# EAGLE design RTC microSD Shield (EAGLE 5.11)
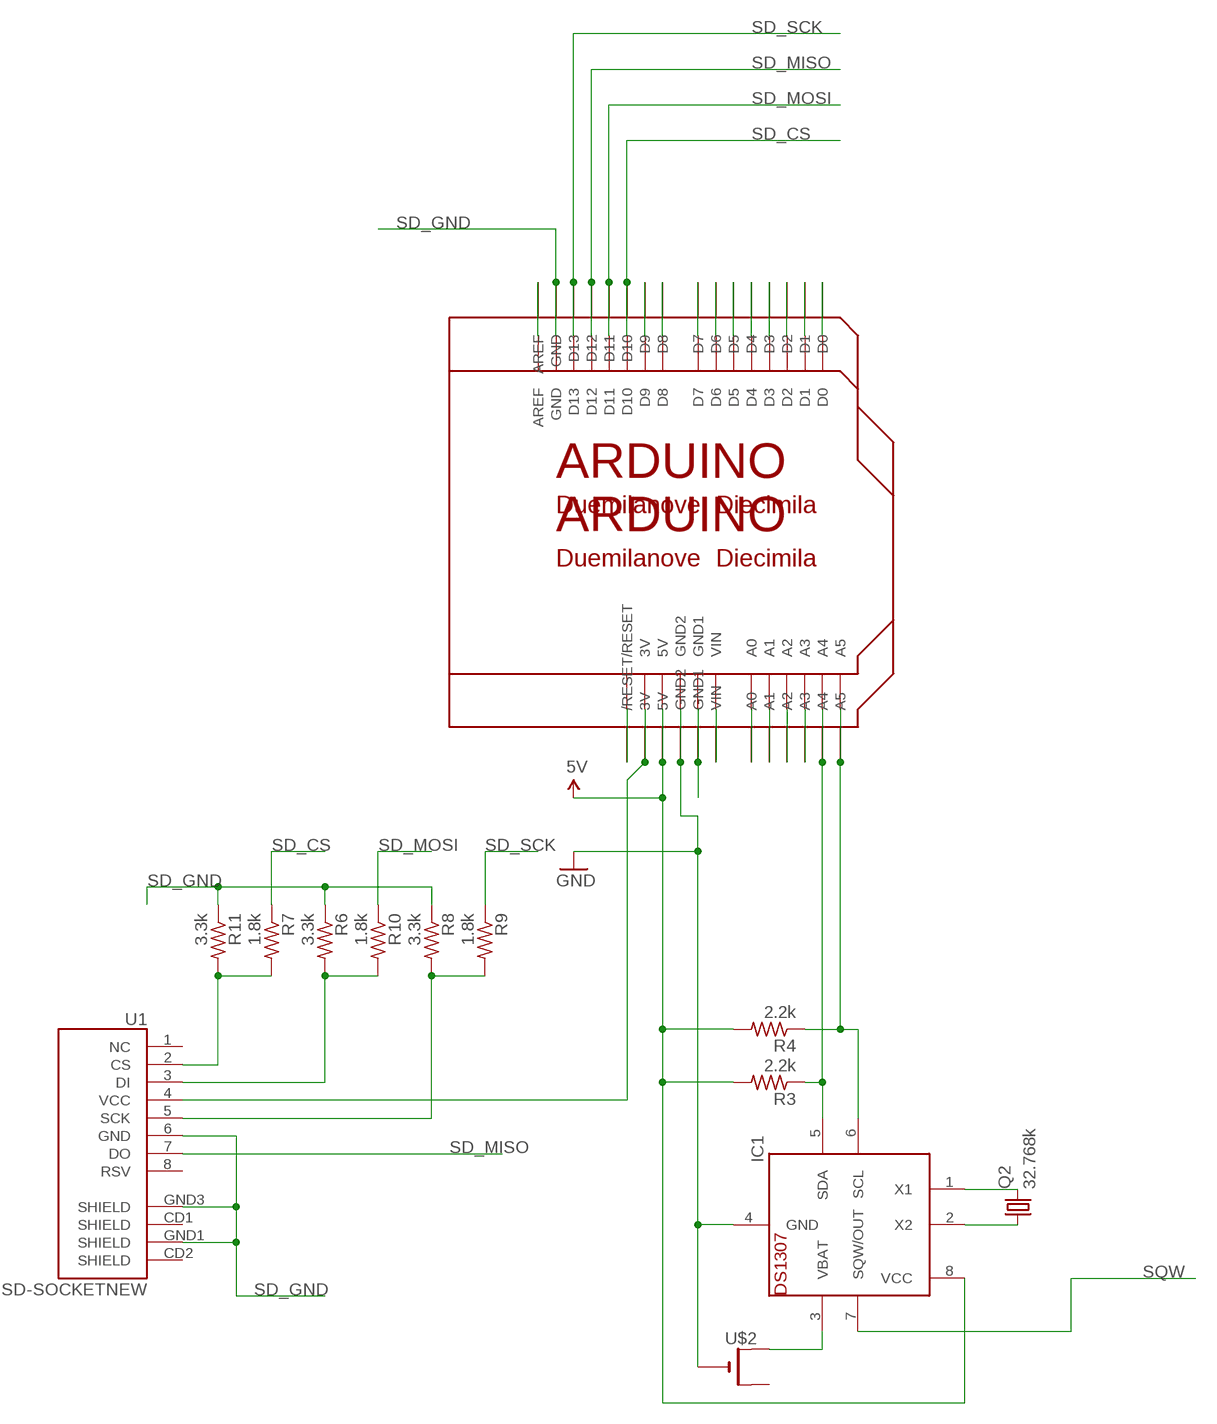
[diagram p0: schematic, sheet 1]

## Parts
IC1  DS1307  [DIL08]
Q2  32.768k  CRYSTALTC26H  [TC26H]
R3  2.2k  R-US_0207/10  [0207/10]
R4  2.2k  R-US_0207/10  [0207/10]
R6  3.3k  R-US_0207/10  [0207/10]
R7  1.8k  R-US_0207/10  [0207/10]
R8  3.3k  R-US_0207/10  [0207/10]
R9  1.8k  R-US_0207/10  [0207/10]
R10  1.8k  R-US_0207/10  [0207/10]
R11  3.3k  R-US_0207/10  [0207/10]
U1  USD-SOCKETNEW  [MICRO-SD-SOCKET-PP]
U$1  ARDUINOUNO  [ARDUINO]
U$2  CR1220THM  [CR1220-THM]
U$3  ARDUINOUNO  [ARDUINO]

## Nets
5V: IC1.8(VCC) R3.2 R4.2 U$1.5V U$3.5V
GND: IC1.4(GND) U$1.GND2 U$2.- U$3.GND2
N$1: U$1.AREF U$3.AREF
N$2: U$1.GND1 U$3.GND1
N$3: U$1.D9 U$3.D9
N$4: IC1.3(VBAT) U$2.+1(+)
N$5: IC1.1(X1) Q2.2
N$6: IC1.2(X2) Q2.1
N$7: IC1.5(SDA) R3.1 U$1.A4 U$3.A4
N$8: IC1.6(SCL) R4.1 U$1.A5 U$3.A5
N$9: U$1.D8 U$3.D8
N$10: U1.4(VCC) U$1.3V U$3.3V
N$11: R7.2 R11.2 U1.2(CS)
N$12: R6.2 R10.2 U1.3(DI)
N$13: R8.2 R9.2 U1.5(SCK)
N$14: U$1.D7 U$3.D7
N$15: U$1.D6 U$3.D6
N$16: U$1.D5 U$3.D5
N$17: U$1.D4 U$3.D4
N$18: U$1.D3 U$3.D3
N$19: U$1.D2 U$3.D2
N$20: U$1.D1 U$3.D1
N$21: U$1.D0 U$3.D0
N$22: U$1.RESET(/RESET) U$3.RESET(/RESET)
N$23: U$1.VIN U$3.VIN
N$24: U$1.A0 U$3.A0
N$25: U$1.A1 U$3.A1
N$26: U$1.A2 U$3.A2
N$27: U$1.A3 U$3.A3
SD_CS: R7.1 U$1.D10 U$3.D10
SD_GND: R6.1 R8.1 R11.1 U1.6(GND) U1.GND1(SHIELD) U1.GND3(SHIELD) U$1.GND U$3.GND
SD_MISO: U1.7(DO) U$1.D12 U$3.D12
SD_MOSI: R10.1 U$1.D11 U$3.D11
SD_SCK: R9.1 U$1.D13 U$3.D13
SQW: IC1.7(SQW/OUT)
Unconnected: U1.1(NC) U1.8(RSV) U1.CD1(SHIELD) U1.CD2(SHIELD) U$2.+2(+1)

## Library data of the parts
IC1 = adafruit:DS1307: DS1307 Real time clock (RTC) with battery backup ability. Talk to it via i2c
Q2 = crystal:CRYSTAL: CRYSTAL; OC_FARNELL: unknown; OC_NEWARK: unknown
R3 R4 R6-R11 = rcl:R-US_: RESISTOR, American symbol
U1 = SparkFun:USD-SOCKET: microSD Socket Push-push type uSD socket. Schematic element and footprint production proven. Spark Fun Electronics SKU : PRT-00127. tDoc lines correctly indicate media card edge positions when inserting (unlocked, locked, depressed).
U$1 U$3 = adafruit:ARDUINO: Arduino Diecimila/Duemilanove Make a shield with ease, this package has all the named pins as well as the two mounting drill holes and an outline of the USB and DC power connector. The outline is on the DIMENSION layer, so if your board house uses it they will cut the outline to match. http://www.ladyada.net/library/pcb/eaglelibrary.html
U$2 = adafruit:CR1220: CR1216/CR1220/CR1225 12mm 3V lithium coin cell Great for battery packup. Both SMT and THM holders. Note the THM package has the ground pads on both sides of the PCB so that the masks are the same - this reduces the cost

## Board
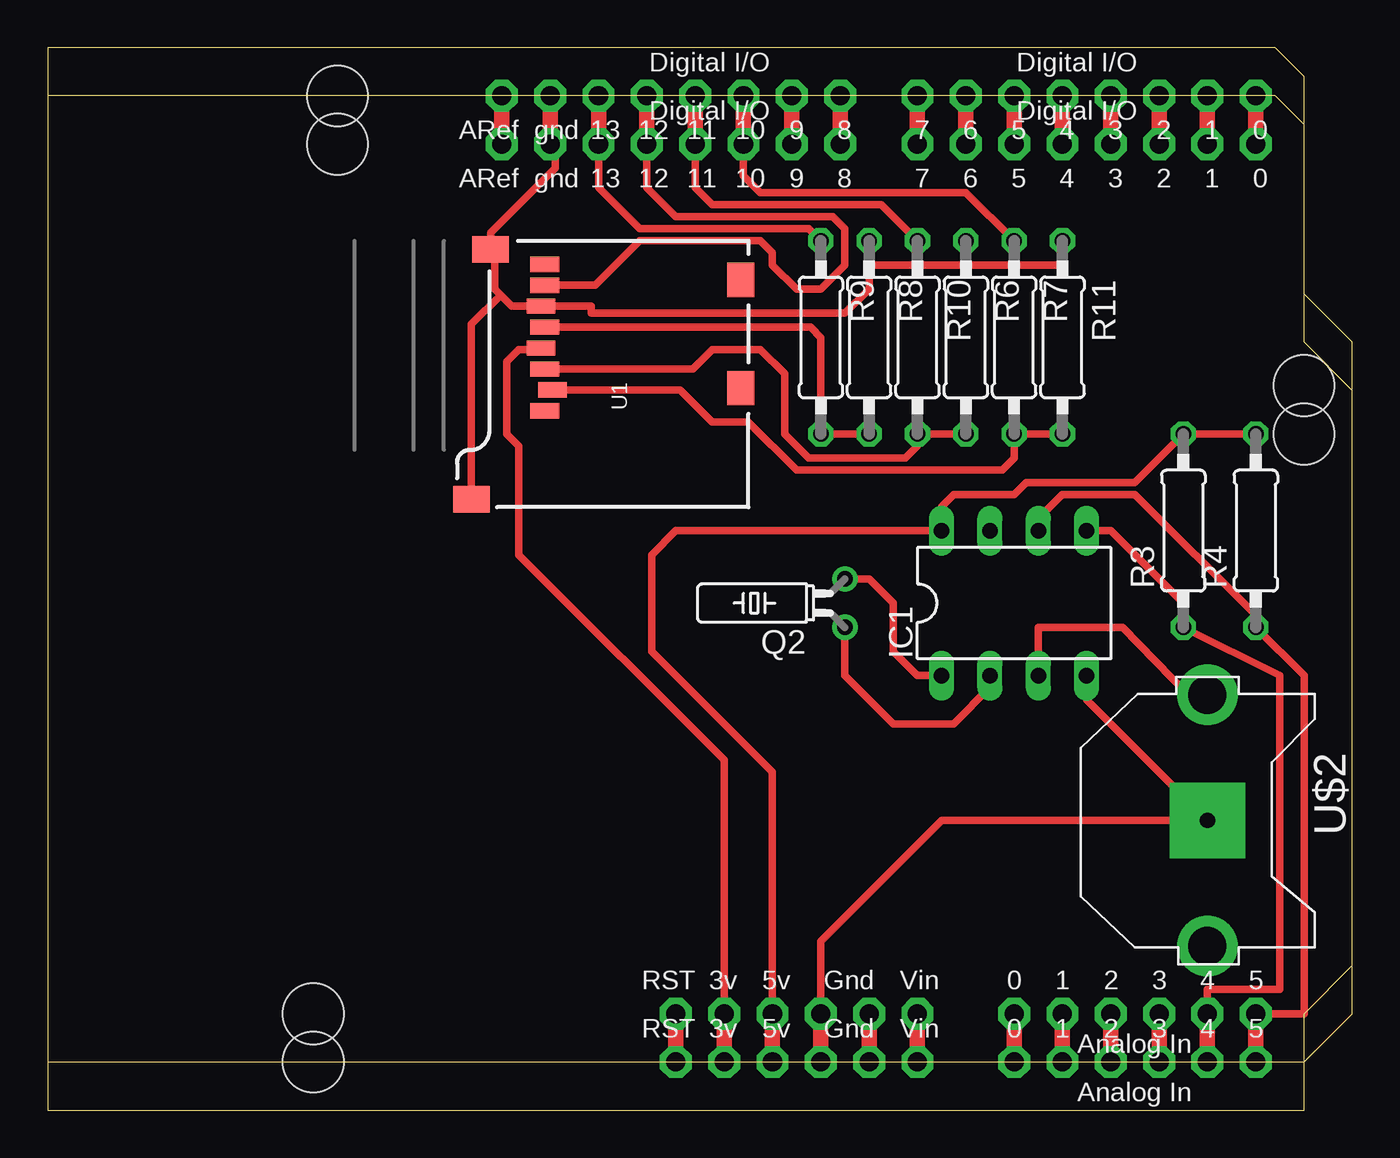
[diagram p1: board, top side]

Size 68.58 x 55.88 mm. Coordinates in mm from the lower left corner, seen from the top.
Copper layers (1*16): Top 0.035mm / dielectric 1.5mm / Bottom 0.035mm
Design rules "default": minimum track width 10mil, minimum drill 24mil, track to track 8mil, track to pad 8mil, pad to pad 8mil, via to via 8mil, smd to smd 8mil, copper to edge 40mil, drill to drill 8mil, minimum pad ring 10mil, minimum via ring 8mil, stop-mask expansion 4mil, vias tented up to drill 0mil, thermal gap 10mil

### Footprints (pad centres in the part's own frame; a part is rotated, then mirrored left to right if it is on the bottom)
DIL08 = drill 0.813 long: 1 -3.81,-3.81; 2 -1.27,-3.81; 3 1.27,-3.81; 4 3.81,-3.81; 5 3.81,3.81; 6 1.27,3.81; 7 -1.27,3.81; 8 -3.81,3.81
TC26H = drill 0.813 round: 1 -1.27,0; 2 1.27,0
0207/10 = drill 0.813 octagon: 1 -5.08,0; 2 5.08,0
MICRO-SD-SOCKET-PP = smd 0.8 x 1.5: 1 -8.94,10.7; 2 -7.84,10.3; 3 -6.74,10.7; 4 -5.64,10.9; 5 -4.54,10.7; 6 -3.44,10.9; 7 -2.34,10.7; 8 -1.24,10.7 | smd 1.8 x 1.4: CD1 -2.05,0.4; CD2 -7.75,0.4 | smd 1.4 x 1.9: GND1 -13.6,14.55; GND3 -0.45,13.55
ARDUINO = drill 1 pad 1.676 octagon: 3V 35.56,2.54; 5V 38.1,2.54; A0 50.8,2.54; A1 53.34,2.54; A2 55.88,2.54; A3 58.42,2.54; A4 60.96,2.54; A5 63.5,2.54; AREF 23.876,50.8; D0 63.5,50.8; D1 60.96,50.8; D2 58.42,50.8; D3 55.88,50.8; D4 53.34,50.8; D5 50.8,50.8; D6 48.26,50.8; D7 45.72,50.8; D8 41.656,50.8; D9 39.116,50.8; D10 36.576,50.8; D11 34.036,50.8; D12 31.496,50.8; D13 28.956,50.8; GND 26.416,50.8; GND1 43.18,2.54; GND2 40.64,2.54; RESET 33.02,2.54; VIN 45.72,2.54 | hole 3.2: 15.24,50.8; 66.04,35.56; 13.97,2.54
CR1220-THM = drill 2 pad 3.175 round: +1 -6.604,0; +2 6.604,0 | drill 0.8 pad 3.962 square: - 0,0

### Placement (x,y rotation side)
IC1  50.8,26.67 0 top
Q2  41.91,26.67 90 top
R3  59.69,30.48 90 top
R4  63.5,30.48 90 top
R6  48.26,40.64 270 top
R7  50.8,40.64 270 top
R8  43.18,40.64 270 top
R9  40.64,40.64 270 top
R10  45.72,40.64 270 top
R11  53.34,40.64 270 top
U1  36.83,45.72 90 top
U$1  0,0 0 top
U$2  60.96,15.24 270 top
U$3  0,2.54 0 top

### Tracks (layer width: path | path; a pad name or v marks a point on that pad's centre or on a via)
5V
  Top 0.406: R4.2 R3.2 57.15,33.02 51.44,33.02 50.8,32.38 47.62,32.38 46.99,31.75 IC1.8 33.02,30.48 31.75,29.21 31.75,24.13 38.1,17.78 U$3.5V
  Top 0.813: U$1.5V U$3.5V
GND
  Top 0.406: U$3.GND2 40.64,8.89 46.99,15.24 U$2.- 54.61,21.59 IC1.4
  Top 0.813: U$1.GND2 U$3.GND2
N$1
  Top 0.813: U$1.AREF U$3.AREF
N$2
  Top 0.813: U$1.GND1 U$3.GND1
N$3
  Top 0.813: U$1.D9 U$3.D9
N$4
  Top 0.406: U$2.+1 59.94,21.84 56.52,25.4 52.07,25.4 IC1.3
N$5
  Top 0.406: IC1.1 45.72,22.86 44.45,24.13 44.45,26.67 43.18,27.94 Q2.2
N$6
  Top 0.406: IC1.2 49.53,22.23 47.62,20.32 44.45,20.32 41.91,22.86 Q2.1
N$7
  Top 0.406: IC1.5 55.88,30.48 59.69,26.67 R3.1 64.77,22.86 64.77,6.35 60.96,6.35 U$3.A4
  Top 0.813: U$1.A4 U$3.A4
N$8
  Top 0.406: IC1.6 52.07,31.11 53.34,32.38 57.15,32.38 63.5,26.04 R4.1 66.04,22.86 66.04,5.08 U$3.A5
  Top 0.813: U$1.A5 U$3.A5
N$9
  Top 0.813: U$1.D8 U$3.D8
N$10
  Top 0.406: U$3.3V 35.56,18.41 24.77,29.21 24.77,34.92 24.13,35.56 24.13,39.37 24.77,40.01 25.86,40.01 U1.4
  Top 0.813: U$1.3V U$3.3V
N$11
  Top 0.406: R11.2 R7.2 50.8,34.29 50.16,33.66 39.37,33.66 36.83,36.2 34.92,36.2 33.24,37.88 U1.2
N$12
  Top 0.406: U1.3 33.9,38.98 34.92,40.01 37.47,40.01 38.73,38.73 38.73,35.56 40.01,34.29 45.09,34.29 45.72,34.92 R10.2 R6.2
N$13
  Top 0.406: U1.5 40.1,41.18 40.64,40.64 R9.2 R8.2
N$14
  Top 0.813: U$1.D7 U$3.D7
N$15
  Top 0.813: U$1.D6 U$3.D6
N$16
  Top 0.813: U$1.D5 U$3.D5
N$17
  Top 0.813: U$1.D4 U$3.D4
N$18
  Top 0.813: U$1.D3 U$3.D3
N$19
  Top 0.813: U$1.D2 U$3.D2
N$20
  Top 0.813: U$1.D1 U$3.D1
N$21
  Top 0.813: U$1.D0 U$3.D0
N$22
  Top 0.813: U$1.RESET U$3.RESET
N$23
  Top 0.813: U$1.VIN U$3.VIN
N$24
  Top 0.813: U$1.A0 U$3.A0
N$25
  Top 0.813: U$1.A1 U$3.A1
N$26
  Top 0.813: U$1.A2 U$3.A2
N$27
  Top 0.813: U$1.A3 U$3.A3
SD_CS
  Top 0.406: U$1.D10 36.58,49.15 37.47,48.26 48.26,48.26 R7.1
  Top 0.813: U$1.D10 U$3.D10
SD_GND
  Top 0.406: 23.81,42.86 24.39,42.28 U1.6 28.57,42.28 28.57,41.91 41.91,41.91 43.18,43.18 R8.1 43.18,44.45 48.26,44.45 | 23.81,42.86 23.5,43.18 23.5,45.05 U1.GND3 23.28,46.14 26.67,49.53 26.67,50.55 U$1.GND | U1.GND1 22.28,41.33 23.81,42.86 | 48.26,44.45 R6.1 | 48.26,44.45 53.34,44.45 R11.1
  Top 0.813: U$1.GND U$3.GND
SD_MISO
  Top 0.406: U$1.D12 31.5,48.51 33.02,46.99 41.27,46.99 41.91,46.35 41.91,44.45 40.64,43.18 39.37,43.18 38.1,44.45 38.1,45.09 37.47,45.72 31.11,45.72 28.77,43.38 U1.7
  Top 0.813: U$1.D12 U$3.D12
SD_MOSI
  Top 0.406: U$1.D11 34.04,48.51 34.92,47.62 43.81,47.62 R10.1
  Top 0.813: U$1.D11 U$3.D11
SD_SCK
  Top 0.406: U$1.D13 28.96,48.51 31.11,46.35 40.01,46.35 R9.1
  Top 0.813: U$1.D13 U$3.D13